# Altium schematic sheet Power.SchDoc
size A4
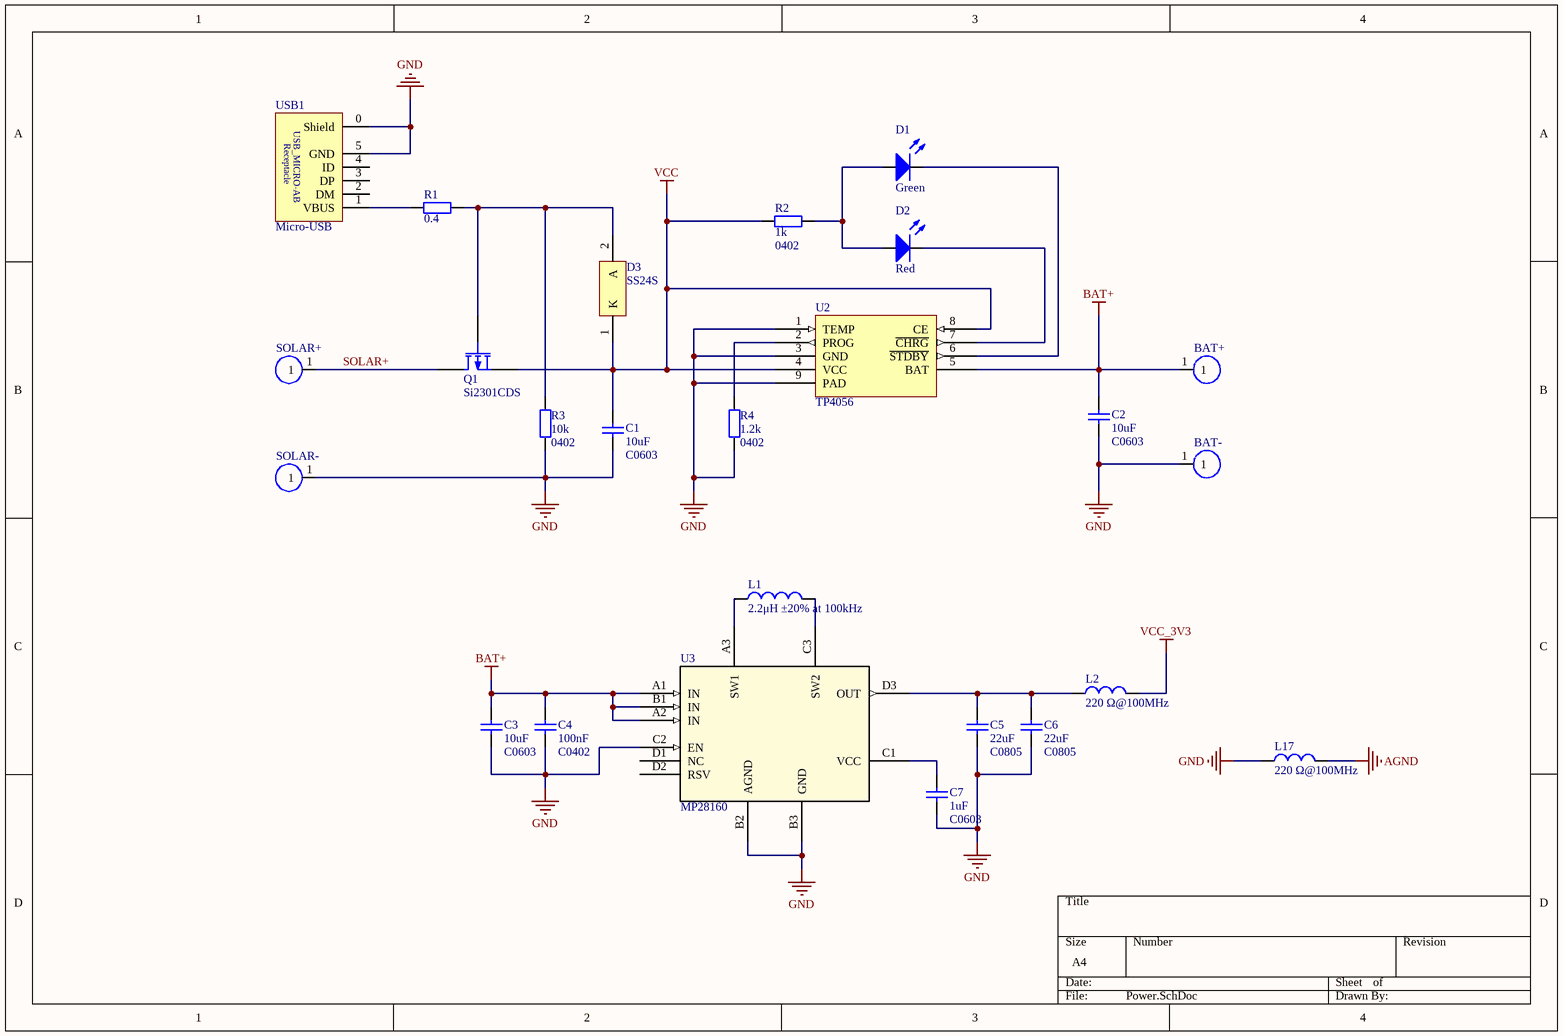
[diagram p0: Power.SchDoc]

## Parts
BAT+  BAT+  [surface_pad]  (value not drawn)
BAT-  BAT-  [surface_pad]  (value not drawn)
C1  10uF  PackageReference: C0603  [1608[0603]]
C2  10uF  PackageReference: C0603  [1608[0603]]
C3  10uF  PackageReference: C0603  [1608[0603]]
C4  100nF  PackageReference: C0402  [0402]
C5  22uF  [C0805]
C6  22uF  [C0805]
C7  1uF  PackageReference: C0603  [1608[0603]]
D1  Green  [0603/K]
D2  Red  [0603/K]
D3  SS24S  [ONSC-SMA-2-403D-02_V]
L1  2.2μH ±20% at 100kHz  [INDP3230X10N]
L2  220 Ω@100MHz  [RESC2012X07N]
L17  220 Ω@100MHz  [RESC2012X07N]
Q1  Si2301CDS  [SOT95P237X112-3N]
R1  0.4  [RESC3216X07N]
R2  1k  PackageReference: 0402  [RESC1005X04N]
R3  10k  PackageReference: 0402  [RESC1005X04N]
R4  1.2k  PackageReference: 0402  [RESC1005X04N]
SOLAR+  SOLAR+  [surface_pad]  (value not drawn)
SOLAR-  SOLAR-  [surface_pad]  (value not drawn)
U2  TP4056  [ESOP-9N]
U3  MP28160  [CSP-12]
USB1  Micro-USB  [USB_Micro_5P4J]

## Nets
AGND: L17.2
BAT+: BAT+.1 C2.2 C3.2 C4.2 U2.5(BAT) U3.A1(IN) U3.A2(IN) U3.B1(IN)
GND: BAT-.1 C1.1 C2.1 C3.1 C4.1 C5.1 C6.1 C7.1 L17.1 R3.1 R4.1 SOLAR-.1 U2.1(TEMP) U2.3(GND) U2.9(PAD) U3.B2(AGND) U3.B3(GND) U3.C2(EN) USB1.0(Shield) USB1.5(GND)
VCC: C1.2 D3.1(K) Q1.2(S) R2.1 U2.4(VCC) U2.8(CE)
VCC_3V3: L2.2
SOLAR+: Q1.3(D) SOLAR+.1
NetC5_2: C5.2 C6.2 L2.1 U3.D3(OUT)
NetC7_2: C7.2 U3.C1(VCC)
NetD1_A: D1.A D2.A R2.2
NetD1_K: D1.K U2.6(~{STDBY})
NetD2_K: D2.K U2.7(~{CHRG})
NetD3_2: D3.2(A) Q1.1(G) R1.2 R3.2
NetL1_1: L1.1 U3.A3(SW1)
NetL1_2: L1.2 U3.C3(SW2)
NetR1_1: R1.1 USB1.1(VBUS)
NetR4_2: R4.2 U2.2(PROG)

Not connected (* = marked no-connect by the designer): U3 D1(NC) D2(RSV); USB1 2(DM) 3(DP) 4(ID)

## Notes on the sheet
- (in symbol USB/Micro-AB) USB_MICRO-AB; Receptacle

## Library data of the parts
BAT+ BAT- SOLAR+ SOLAR- = SURFACE_PAD: PAD
C1-C3 = C1608X5R1A106K080AC: Capacitor (0603,X5R,10uF,DC 10V,±10%) TDK; Published: 8-Jun-2000; LatestRevisionDate: 29-May-2009; LatestRevisionNote: IPC-7351 Footprint Added.; Publisher: Altium Limited; PackageDescription: Chip Capacitor; Value: 10uF
C4 = CGA2B2X5R1A104K050BA: Capacitor (0402,X5R,100nF,DC 10V,±10%) TDK; Published: 8-Jun-2000; LatestRevisionDate: 29-May-2009; LatestRevisionNote: IPC-7351 Footprint Added.; Publisher: Altium Limited; PackageDescription: Chip Capacitor; Value: 100nF
C5 C6 = C2012X5R1A226K125AB: Capacitor (0805,X5R,22uF,DC 10V,±10%) TDK; Published: 8-Jun-2000; LatestRevisionDate: 29-May-2009; LatestRevisionNote: IPC-7351 Footprint Added.; Publisher: Altium Limited; PackageDescription: Chip Capacitor; Value: 22uF; PackageReference: C0805
C7 = CGA3E2X5R1A105K080AA: Capacitor (0603,X5R,1uF,DC 10V,+/-10%) TDK; Published: 8-Jun-2000; LatestRevisionDate: 29-May-2009; LatestRevisionNote: IPC-7351 Footprint Added.; Publisher: Altium Limited; PackageDescription: Chip Capacitor; Value: 1uF
D1 = TLMG1100-GS08: Standard 0603 SMD LED, Green, 2.1V,-40 °C to +100 °C; Published: 8-Jun-2000; LatestRevisionDate: 17-Jul-2002; LatestRevisionNote: Re-released for DXP Platform.; PackageVersion: Feb-2002; PackageReference: 0603; Publisher: Altium Limited; PackageDescription: SM LED; 2 Flat Leads; Valid: Green
D2 = TLMS1100-GS08: Standard 0603 SMD LED, Red, 2.1V,-40 °C to +100 °C; Published: 8-Jun-2000; LatestRevisionDate: 17-Jul-2002; LatestRevisionNote: Re-released for DXP Platform.; PackageVersion: Feb-2002; PackageReference: 0603; Publisher: Altium Limited; PackageDescription: SM LED; 2 Flat Leads; Valid: Red
D3 = SS24S: Schottky Power Rectifier, 2-Pin SMA, VRRM=40V , VF=0.517V at IF=2.0A , Pb-Free, Tape and Reel; Manufacturer: On Semiconductor; Configuration: Single; IFSM Max (A): 40; DatasheetVersion: Rev. 7; PackageVersion: Rev. G, 07/2012; PackageReference: SMA-2-403D-02; PackageDescription: 2-Pin Small Molded Package, J-Bend Lead, Body 2.605 x 4.315 mm; Supplier 1: Digi-Key; Supplier Part Number 1: SS16T3GOSTR-ND; Supplier 2: Digi-Key; Supplier Part Number 2: SS16T3GOSCT-ND; Supplier 3: Digi-Key; Supplier Part Number 3: SS16T3GOSDKR-ND; Supplier 4: Farnell; Supplier Part Number 4: 2317421; Supplier 5: Farnell; Supplier Part Number 5: 1900107; Supplier 6: Newark; Supplier Part Number 6: 98H0976; Supplier 7: Newark; Supplier Part Number 7: 10N9613; Supplier 8: Mouser; Supplier Part Number 8: 863-SS16T3G; Packing: Tape and Reel; RoHS: TRUE; Mounting Technology: Surface Mount; PartNumber: SS24S; ComponentLink1Description: Manufacturer URL; ComponentLink1URL: http://www.onsemi.com/; ComponentLink2Description: Datasheet; ComponentLink2URL: http://www.onsemi.cn/pub_link/Collateral/SS16-D.PDF; ComponentLink3Description: Package Specification; ComponentLink3URL: http://www.onsemi.com/pub_link/Collateral/403D-02.PDF
L1 = SPM3010T-2R2M-LR: inductor_commercial_power, 2.2μH ±20% at 100kHz, 2.6A, 3.2mm*3.0mm, -40～125°C; PackageReference: 3230; PackageDescription: inductor, 2-Leads, Body 2.00x1.25mm, IPC Medium Density; Value: 2.2μH ±20% at 100kHz
L2 L17 = FBMH2012HM221-T: 220Ω, 2 A, 0805/2012 (EIA/JIS); PackageReference: 0805; PackageDescription: Bead Inductor, 2-Leads, Body 2.00x1.25mm, IPC Medium Density; Value: 220 Ω@100MHz
Q1 = Si2301CDS: P-Channel MOSFET,VDS=-20V,VGS=8V,ID=3.1A,VGS(th)Min=0.4V,SOT-23; Published: 8-Jun-2000; LatestRevisionDate: 17-Jul-2002; LatestRevisionNote: Re-released for DXP Platform.; PackageVersion: 1995/1996; PackageReference: SOT23; Publisher: Altium Limited; PackageDescription: SOT23, 3-Leads, Body 2.92x2.37mm, Pitch 0.95mm, IPC Medium Density
R1 = PE1206FRF470R4L: Resistor 1206(3216) 0.4Ω ±1% 1W AUTOMOTIVE GRADEPE_L series; PackageReference: 1206; PackageDescription: Chip Resistor, 2-Leads, Body 3.20x1.60mm, IPC Medium Density; Value: 0.4
R2 = RC0402FR-071KL: Resistor 0402(1005) 1kΩ ±1%; PackageDescription: Chip Resistor, 2-Leads, Body 1.00x0.50mm, IPC Medium Density; Value: 1k
R3 = RC0402FR-0710KL: Resistor 0402(1005) 10kΩ ±1%; PackageDescription: Chip Resistor, 2-Leads, Body 1.00x0.50mm, IPC Medium Density; Value: 10k
R4 = RC0402FR-071K2L: Resistor 0402(1005) 1.2kΩ ±1%; PackageDescription: Chip Resistor, 2-Leads, Body 1.00x0.50mm, IPC Medium Density; Value: 1.2k
U2 = TP4056: 1A线性锂离子电池充电器
U3 = MP28160: 5.5V/0.5A High-EfficiencyIntegrated Buck-Boost Converterwith 3.3V FixedOutput in 1.4x1.8mm CSP Package; Vendor: MPS; Iout: 500mA; Vin: 2.5V to 5.5V; Manufacturer_Part_Number: CSP-12; Vout: 3.3V
USB1 = USB/Micro-AB: Receptacle,Micro 5脚贴片 不带定位柱